# Altium project Analog_Project_Sem_3.PrjPcb
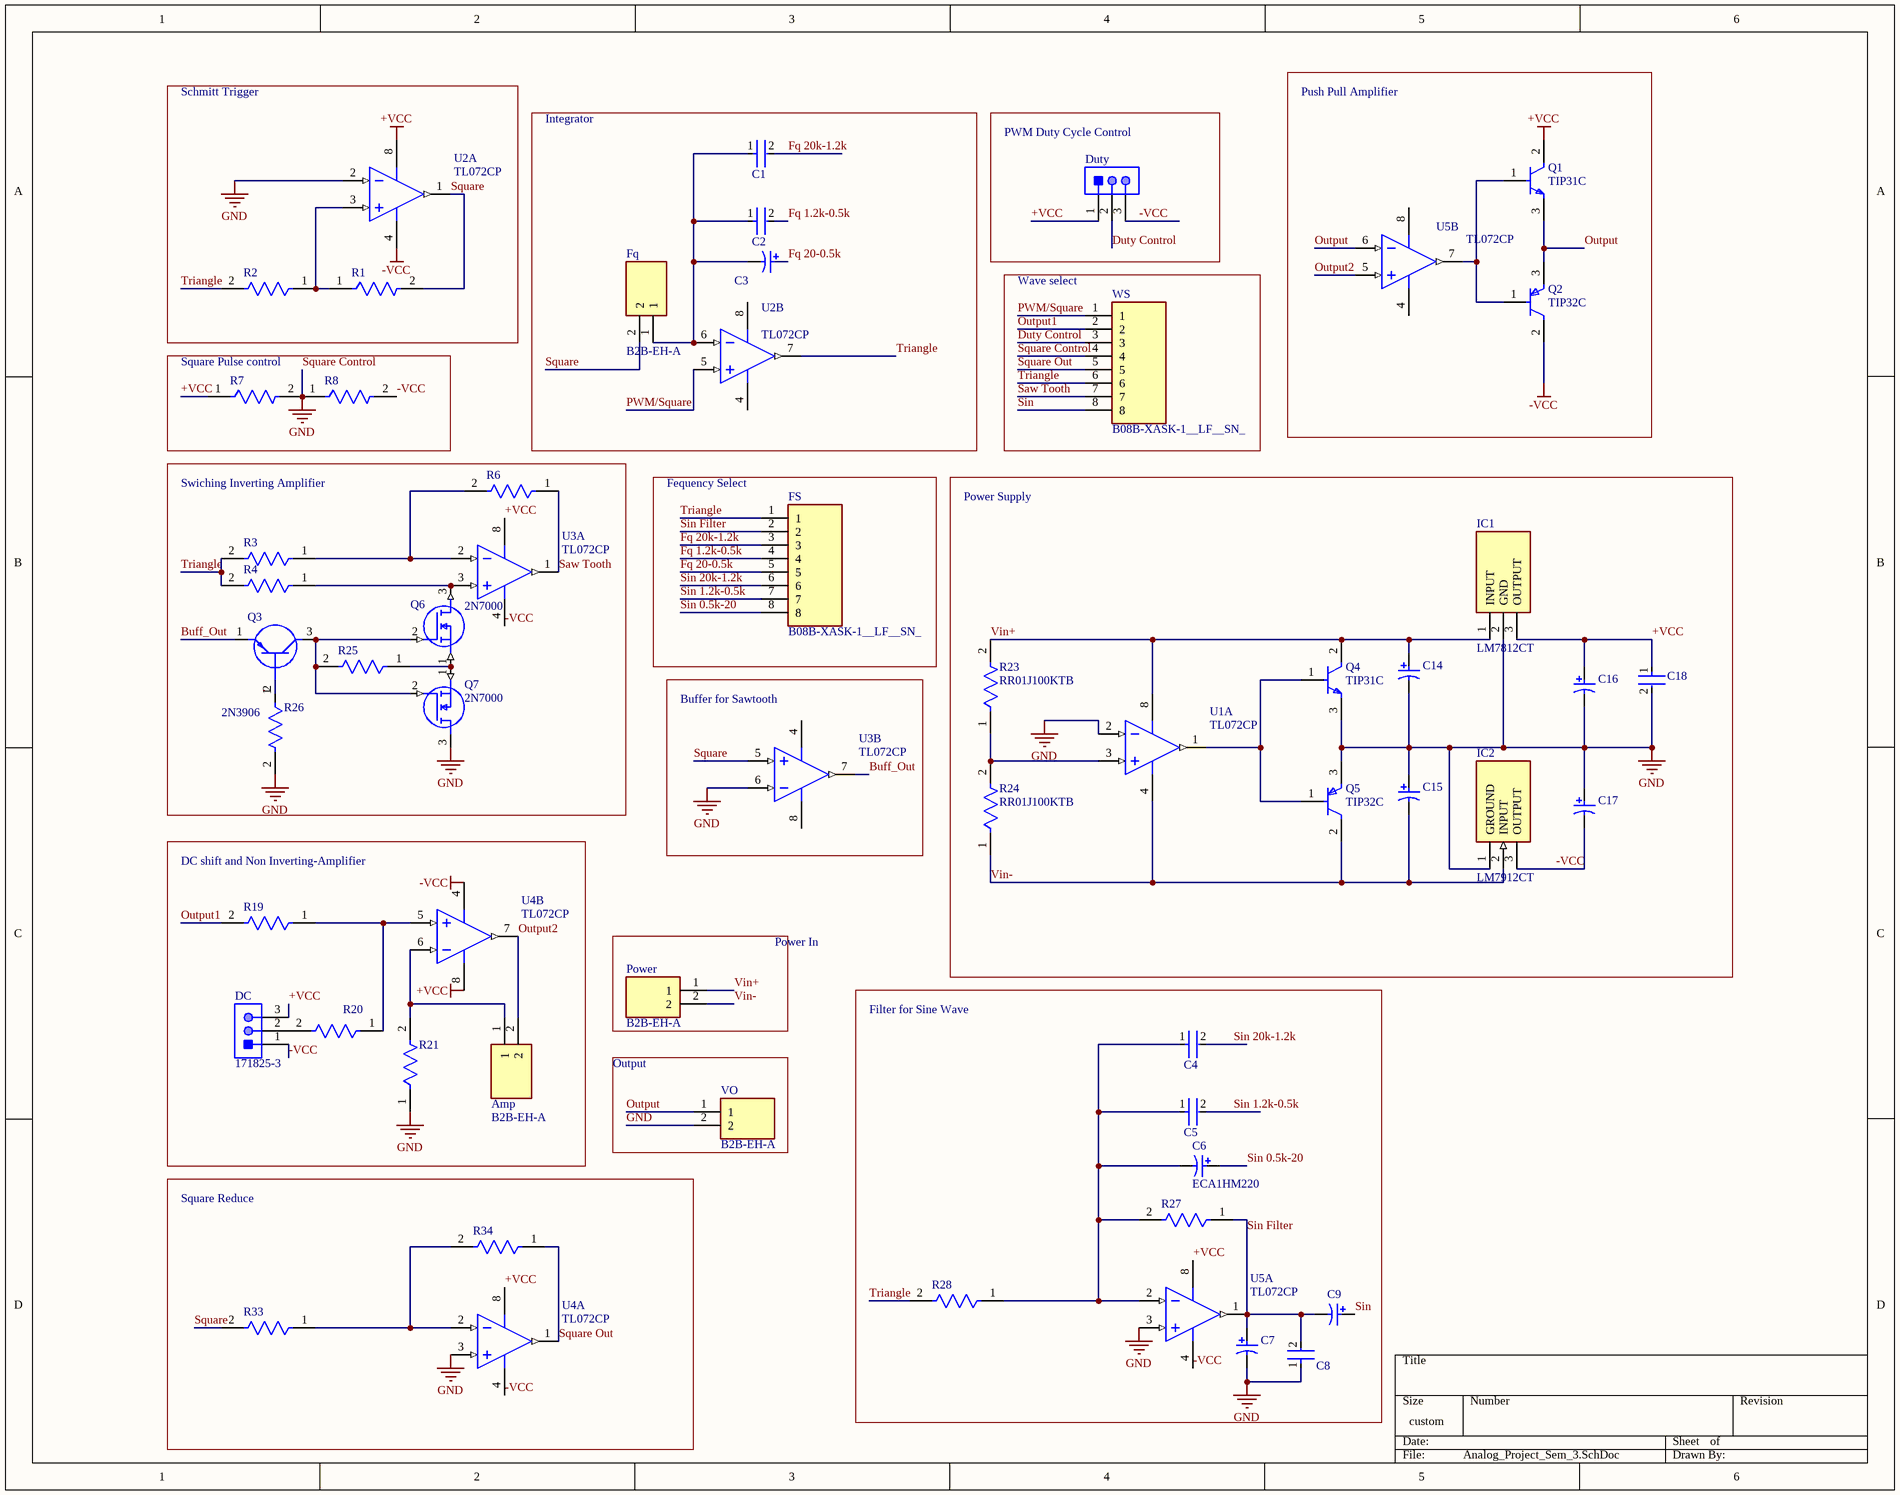
[diagram p0: Analog_Project_Sem_3.SchDoc]
1 sheet, 54 parts. Net scope: global (net labels, ports and power ports of the same name join across sheets).
Board files: PCB1.PcbDoc, Analog_Project_Sem_3.PcbDoc

## Sheet Analog_Project_Sem_3.SchDoc
size 355 x 279 mm; SheetNumber: 1; SheetTotal: 1

### Parts
Amp  B2B-EH-A  [SHDR2W64P0X250_1X2_750X380X600P]
C1  RCER72A104K1A2H03B  [FP-RCE1A2-MFG]  (value not drawn)
C2  RCER72A104K1A2H03B  [FP-RCE1A2-MFG]  (value not drawn)
C3  ECA1HM220  [CAPPR55-200-1100X500X1200]  (value not drawn)
C4  RCER72A104K1A2H03B  [FP-RCE1A2-MFG]  (value not drawn)
C5  RCER72A104K1A2H03B  [FP-RCE1A2-MFG]  (value not drawn)
C6  ECA1HM220  [CAPPR55-200-1100X500X1200]
C7  ECA1HM220  [CAPPR55-200-1100X500X1200]  (value not drawn)
C8  RCER72A104K1A2H03B  [FP-RCE1A2-MFG]  (value not drawn)
C9  ECA1HM220  [CAPPR55-200-1100X500X1200]  (value not drawn)
C14  ECA1HM220  [CAPPR55-200-1100X500X1200]  (value not drawn)
C15  ECA1HM220  [CAPPR55-200-1100X500X1200]  (value not drawn)
C16  ECA1HM220  [CAPPR55-200-1100X500X1200]  (value not drawn)
C17  ECA1HM220  [CAPPR55-200-1100X500X1200]  (value not drawn)
C18  RCER72A104K1A2H03B  [FP-RCE1A2-MFG]  (value not drawn)
DC  171825-3  [TECO-171825-3_V]
Duty  171825-3  [TECO-171825-3_V]  (value not drawn)
Fq  B2B-EH-A  [SHDR2W64P0X250_1X2_750X380X600P]
FS  B08B-XASK-1__LF__SN_  [SHDR8W60P0X250_1X8_2250X640X880P]
IC1  LM7812CT  [TO254P470X1016X2019-3P]
IC2  LM7912CT  [TO254P483X1016X2261-3P]
Power  B2B-EH-A  [SHDR2W64P0X250_1X2_750X380X600P]
Q1  TIP31C  [FP-TO-220-P0A0015988-MFG]
Q2  TIP32C  [FP-TO-220-P0A0015988-MFG]
Q3  2N3906  [2N5457]
Q4  TIP31C  [FP-TO-220-P0A0015988-MFG]
Q5  TIP32C  [FP-TO-220-P0A0015988-MFG]
Q6  2N7000  [TO-92_(TO-226)]
Q7  2N7000  [TO-92_(TO-226)]
R1  (no value)  [FP-MRS1600-MFG]
R2  (no value)  [FP-MRS1600-MFG]
R3  (no value)  [FP-MRS1600-MFG]
R4  (no value)  [FP-MRS1600-MFG]
R6  (no value)  [FP-MRS1600-MFG]
R7  (no value)  [FP-MRS1600-MFG]
R8  (no value)  [FP-MRS1600-MFG]
R19  (no value)  [FP-MRS1600-MFG]
R20  (no value)  [FP-MRS1600-MFG]
R21  (no value)  [FP-MRS1600-MFG]
R23  RR01J100KTB  [FP-RR01-MFG]
R24  RR01J100KTB  [FP-RR01-MFG]
R25  (no value)  [FP-MRS1600-MFG]
R26  (no value)  [FP-MRS1600-MFG]
R27  (no value)  [FP-MRS1600-MFG]
R28  (no value)  [FP-MRS1600-MFG]
R33  (no value)  [FP-MRS1600-MFG]
R34  (no value)  [FP-MRS1600-MFG]
U1  TL072CP  [P0008A]  (part A of 2)
U2  TL072CP  [P0008A]  (parts A,B of 2)
U3  TL072CP  [P0008A]  (parts A,B of 2)
U4  TL072CP  [P0008A]  (parts A,B of 2)
U5  TL072CP  [P0008A]  (parts A,B of 2)
VO  B2B-EH-A  [SHDR2W64P0X250_1X2_750X380X600P]
WS  B08B-XASK-1__LF__SN_  [SHDR8W60P0X250_1X8_2250X640X880P]

### Blocks framed on the sheet
Schmitt Trigger: R1 R2 U2
Integrator: C1-C3 Fq U2
PWM Duty Cycle Control: Duty
Push Pull Amplifier: Q1 Q2 U5
Wave select: WS
Square Pulse control: R7 R8
Swiching Inverting Amplifier: Q3 Q6 Q7 R3 R4 R6 R25 R26 U3
Fequency Select: FS
Power Supply: C14-C18 IC1 IC2 Q4 Q5 R23 R24 U1
Buffer for Sawtooth: U3
DC shift and Non Inverting-Amplifier: Amp DC R19-R21 U4
Power In: Power
Filter for Sine Wave: C4-C9 R27 R28 U5
Output: VO
Square Reduce: R33 R34 U4

### Nets
+VCC: C16.1 C18.1 DC.3 Duty.1 IC1.3(OUTPUT) Q1.2(C) R7.1 U2.8(VCC+) U3.8(VCC+) U4.8(VCC+) U5.8(VCC+)
-VCC: C17.2 DC.1 Duty.3 IC2.3(OUTPUT) Q2.2(C) R8.2 U2.4(VCC-) U3.4(VCC-) U4.4(VCC-) U5.4(VCC-)
GND: C7.2 C8.1 C14.2 C15.1 C16.2 C17.1 C18.2 IC1.2(GND) IC2.1(GROUND) Q4.3(E) Q5.3(E) Q7.3(D) R7.2 R8.1 R21.1 R26.2 U1.2(IN1-) U2.2(IN1-) U3.6(IN2-) U4.3(IN1+) U5.3(IN1+) VO.2 WS.4  [also labelled Square Control]
Buff_Out: Q3.1(E) U3.7(OUT2)
Duty Control: Duty.2 WS.3
Fq 1.2k-0.5k: C2.2 FS.4
Fq 20-0.5k: C3.1 FS.5
Fq 20k-1.2k: C1.2 FS.3
Output: Q1.3(E) Q2.3(E) U5.6(IN2-) VO.1
Output1: R19.2 WS.2
Output2: Amp.2 U4.7(OUT2) U5.5(IN2+)
PWM/Square: U2.5(IN2+) WS.1
Saw Tooth: R6.1 U3.1(OUT1) WS.7
Sin: C9.1 WS.8
Sin 0.5k-20: C6.1 FS.8
Sin 1.2k-0.5k: C5.2 FS.7
Sin 20k-1.2k: C4.2 FS.6
Sin Filter: C7.1 C8.2 C9.2 FS.2 R27.1 U5.1(OUT1)
Square: Fq.2 R1.2 R33.2 U2.1(OUT1) U3.5(IN2+)
Square Out: R34.1 U4.1(OUT1) WS.5
Triangle: FS.1 R2.2 R3.2 R4.2 R28.2 U2.7(OUT2) WS.6
Vin+: C14.1 IC1.1(INPUT) Power.1 Q4.2(C) R23.2 U1.8(VCC+)
Vin-: C15.2 IC2.2(INPUT) Power.2 Q5.2(C) R24.1 U1.4(VCC-)
NetAmp_1: Amp.1 R21.2 U4.6(IN2-)
NetC1_1: C1.1 C2.1 C3.2 Fq.1 U2.6(IN2-)
NetC4_1: C4.1 C5.1 C6.2 R27.2 R28.1 U5.2(IN1-)
NetDC_2: DC.2 R20.2
NetQ1_1: Q1.1(B) Q2.1(B) U5.7(OUT2)
NetQ3_2: Q3.2(B) R26.1
NetQ3_3: Q3.3(C) Q6.2(G) Q7.2(G) R25.2
NetQ4_1: Q4.1(B) Q5.1(B) U1.1(OUT1)
NetQ6_1: Q6.1(S) Q7.1(S) R25.1
NetQ6_3: Q6.3(D) R4.1 U3.3(IN1+)
NetR1_1: R1.1 R2.1 U2.3(IN1+)
NetR3_1: R3.1 R6.2 U3.2(IN1-)
NetR19_1: R19.1 R20.1 U4.5(IN2+)
NetR23_1: R23.1 R24.2 U1.3(IN1+)
NetR33_1: R33.1 R34.2 U4.2(IN1-)

### Library data of the parts
Amp Fq Power VO = B2B-EH-A: Connector; Manufacturer_Name: JST (JAPAN SOLDERLESS TERMINALS); Datasheet Link: http://www.jst-mfg.com/product/pdf/eng/eEH.pdf; Height: 6mm; Manufacturer_Part_Number: B2B-EH-A
C1 C2 C4 C5 C8 C18 = CMP-06035-023167-1: Cap Ceramic 100nF 100V X7R ±10% Radial 2.5mm +125°C Automotive Bulk; Lead Diameter: 0.5mm; Lead/Base Style: Straight; Resistor Type: Ceramic; Ratings: AEC-Q200; Mount: Through Hole; Termination: Radial; Capacitance: 100nF; Voltage Rating (DC): 100V; Max Operating Temperature: 125°C; Min Operating Temperature: -55°C; Case/Package: Radial; Tolerance: 10%; Length: 0.157inch; Voltage Rating: 100V; Width: 0.098inch; Packaging: Bulk; Package Quantity: 500; Lead Free: Lead Free; Height: 3.5mm; Dielectric: X7R; Height - Seated (Max): 0.138inch; Lead Pitch: 0.098inch
C3 C6 C7 C9 C14-C17 = CMP-1665-00036-2: Aluminum Electrolytic Capacitor, 22 uF, +/- 20%, 50 V, -40 to 85 degC, 2-Pin THD, RoHS, Bulk; Manufacturer: Panasonic; Ripple Current: 100mA; Life (Hours): 2000Hour; Voltage: 50V; Dissipation Factor: 0.12%; Leakage Current: 3uA; Lead/Base Style: Straight; Capacitance: 22uF; Lead Diameter: 0.5mm; Max Operating Temperature: 85degC; Height: 11mm; Package Reference: CAPPR55-200-1100X500X1200; Radiation Hardening: No; RoHSCompliant: true; Termination: Radial; Case/Package: Radial; REACH SVHC: NoSVHC; Height - Seated (Max): 0.472inch; Min Operating Temperature: -40degC; Packaging: Bulk; Manufacturer URL: http://www.panasonic.com/; Length: 11mm; Tolerance: 20%; Voltage Rating: 50V; Voltage Rating (DC): 50V; Datasheet URL: https://industrial.panasonic.com/cdbs/www-data/pdf/RDF0000/ABA0000C1218.pdf; Lead Pitch: 2mm; Ripple Current (AC): 100mA; Package Description: 2-Pin Radial Lead, Dia 5 mm, Height 12 mm; Diameter: 5mm; Datasheet Version: Rev. 05, 10/2016; Package Quantity: 200; Mount: ThroughHole
DC Duty = CMP-2000-07494-1: Male Header, Pitch 2.5 mm, 1 x 3 Position, Height 10.4 mm, Tail Length 3.6 mm, / -20 to 95 degC / , RoHS, Bulk; Manufacturer: TE Connectivity; Mating Alignment: Yes(With); Tail Length: 0.142inch; Mating Post Length: 7.5mm; PCB Thickness: 0.063inch; PCB Mount Alignment: No(Without); Voltage Rating: 350V; Max Voltage Rating (AC): 250V; Plating Thickness: 0.8um; PCB Mounting Orientation: Vertical; Number of Positions: 3; PCB Mount Retention: Without; Max Current Rating: 3.5A; Max Voltage Rating (DC): 350.25kV; Pitch: 2.5mm; Approvals: UL; Contact Resistance: 20mOhm; Mount: ThroughHole; Length: 7.5mm; Orientation: Straight; Contact Mating Length: 0.295inch; Contact Material: Brass; Housing Material: Nylon; Package Description: Male Header, Pitch 2.5 mm, 1 x 3 Position, Height 10.4 mm, Tail Length 3.6 mm; Colour: Natural; Backwall/Post Interruptions: No(Without); Min Operating Temperature: -20degC; Mating Retention: Yes(With); Connector Type: Header; Packaging: Bag; RoHSCompliant: True; Package Reference: 171825-3; Contact Shape: Square; Strain Relief: No(Without); Contact Gender: Male; Number of Contacts: 3; Manufacturer URL: http://www.te.com/; Height: 0.409inch; Contact Retention: No(Without); Datasheet Version: Rev. Y3, 12/2016; Panel Mount Retention: No(Without); Datasheet URL: http://www.te.com/commerce/DocumentDelivery/DDEController?Action=showdoc&DocId=Customer+Drawing%7F171825%7FY3%7Fpdf%7FEnglish%7FENG_CD_171825_Y3.pdf%7F171825-3; Termination: Solder; Mounting Technology: ThroughHole; Max Operating Temperature: 95degC; Flammability Rating: UL94V-0; REACH SVHC: NoSVHC; Housing Colour: Natural; Package Quantity: 1000; Number of Rows: 1; Depth: 4.9mm; Contact Plating: Tin
FS WS = B08B-XASK-1__LF__SN_: Connector; Manufacturer_Name: JST (JAPAN SOLDERLESS TERMINALS); Manufacturer_Part_Number: B08B-XASK-1 (LF)(SN); Datasheet Link: http://uk.rs-online.com/web/p/products/1667521; Height: 8.8mm
IC1 = LM7812CT: Integrated Circuit; Manufacturer_Name: onsemi; Datasheet Link: https://datasheet.datasheetarchive.com/originals/distributors/Datasheets_SAMA/704b005d7d2d9ced5864f40b6609c1bc.pdf; Height: 4.7mm; Manufacturer_Part_Number: LM7812CT; Mouser Part Number: 512-LM7812CT; Mouser Price/Stock: https://www.mouser.co.uk/ProductDetail/ON-Semiconductor-Fairchild/LM7812CT?qs=VOMQJJE%252BBNkfAU1Xmn60XA%3D%3D; Arrow Part Number: LM7812CT; Arrow Price/Stock: https://www.arrow.com/en/products/lm7812ct/on-semiconductor
IC2 = LM7912CT: Power Supply; Manufacturer_Name: onsemi; Datasheet Link: https://componentsearchengine.com/Datasheets/2/LM7912CT.pdf; Height: 4.83mm; Manufacturer_Part_Number: LM7912CT; Mouser Part Number: 512-LM7912CT; Mouser Price/Stock: https://www.mouser.com/Search/Refine.aspx?Keyword=512-LM7912CT; Arrow Part Number: LM7912CT; Arrow Price/Stock: https://www.arrow.com/en/products/lm7912ct/on-semiconductor
Q1 Q4 = CMP-12195-000001-1: TRANS NPN 100V 3A TO-220; Manufacturer: STMicroelectronics; Hfe Max: 50; Number Of Npn: 1; Max Junction Temp: +150°C; Standoff Height: 3.5mm; Emitter Base Voltage: 5V; Collector Emitter Saturation Voltage: 1.2V; Power Dissipation: 2W; Hfe Testvce: 4V; Hfe Min: 10; Device Class L2: Transistors; ComponentLink2URL: https://www.st.com/resource/en/datasheet/tip31c.pdf; Device Class L1: Discrete Semiconductors; Digikey Description: TRANS NPN 100V 3A TO-220; Max Collector Current: 3A; RoHS: TRUE; Height: 19.68mm; Mouser Description: Bipolar Transistors - BJT NPN Gen Pur Power; Number Of Elements: 1; Package: TO-220-P0A0015988; Temperature: to +150°C; Octopart: https://octopart.com/tip31c-stmicroelectronics-15555; Manufacturer Part Number: TIP31C; Category: Trans; Hfe Testic: 3A; Lead Free: Yes; Collector Base Voltage: 100V; Device Class L3: BJTs; Collector Emitter Voltage: 100V; Automotive: No; ComponentLink2Description: Datasheet; Temperature Range High: +150°C
Q2 Q5 = CMP-12195-000005-1: TRANS PNP 100V 3A TO-220; Manufacturer: STMicroelectronics; Standoff Height: 3.5mm; Number Of Pnp: 1; Max Collector Current: -3A; Emitter Base Voltage: -5V; Collector Emitter Voltage: -100V; Hfe Testvce: -4V; Hfe Max: 50; Collector Emitter Saturation Voltage: -1.2V; Power Dissipation: 2W; Max Junction Temp: +150°C; Hfe Min: 10; Device Class L3: BJTs; Mouser Description: Original ST Microelectronics Transistor, 100V, 3A, .22 Ohm, TO-220 Package; ComponentLink2Description: Datasheet; Device Class L1: Discrete Semiconductors; Automotive: No; Number Of Elements: 1; Category: Trans; Collector Base Voltage: -100V; Package: TO-220-P0A0015988; Height: 19.68mm; Lead Free: Yes; ComponentLink2URL: https://www.st.com/resource/en/datasheet/tip32c.pdf; Hfe Testic: -3A; RoHS: TRUE; Temperature Range High: +150°C; Temperature: to +150°C; Device Class L2: Transistors; Digikey Description: TRANS PNP 100V 3A TO-220; Octopart: https://octopart.com/tip32c-stmicroelectronics-353617; Manufacturer Part Number: TIP32C
Q3 = 2N3906: Transistor BJT PNP; Manufacturer_Name: Central Semiconductor; Datasheet Link: http://www.mouser.com/datasheet/2/68/2n3905-29545.pdf; Height: 5.33mm; Manufacturer_Part_Number: 2N3906; Mouser Part Number: 610-2N3906; Mouser Price/Stock: https://www.mouser.com/Search/Refine.aspx?Keyword=610-2N3906
Q6 Q7 = 2N7000: MOSFET (N-Channel); Manufacturer_Name: onsemi; Datasheet Link: http://www.onsemi.com/pub/Collateral/NDS7002A-D.PDF; Height: 5.33mm; Manufacturer_Part_Number: 2N7000; Mouser Part Number: 512-2N7000; Mouser Price/Stock: https://www.mouser.co.uk/ProductDetail/onsemi-Fairchild/2N7000?qs=FOlmdCx%252BAA2o%2FKZOTk%2F3hg%3D%3D; Arrow Part Number: 2N7000; Arrow Price/Stock: https://www.arrow.com/en/products/2n7000/on-semiconductor?region=europe
R1-R4 R6-R8 R19-R21 R25-R28 R33 R34 = CMP-02408-000019-1: RES 20K OHM 0.4W 1% AXIAL; Max Power Dissipation: 400mW; Temperature Coefficient: 50ppm/°C; Resistance: 20kR; Technology: THIN FILM; Max Operating Temperature: 155°C; Number of Terminations: 2; RoHS Compliant: Yes; Packaging: Tape and Reel; Radiation Hardening: No; Contact Plating: Tin; Military Standard: Not; Construction: Cylindrical; Diameter: 1.6mm; Tolerance: 1%; Mount: Through Hole; Power Rating: 400mW; Case/Package: Conformal; Termination: Axial; Length: 3.6mm; Min Operating Temperature: -55°C; Resistor Type: Metal Film; Series: MRS16
R23 R24 = CMP-03212-000008-1: RES 100K OHM 5% 1W AXIAL; Number of Resistors: 1; Temperature Coefficient: 300ppm/°C; Voltage Rating: 350V; Resistance: 100kR; Package Quantity: 5000; Power Rating: 1W; Packaging: Ammo Pack; Min Operating Temperature: -55°C; Number of Terminations: 2; Resistor Type: Power resistor; Length: 6.8mm; ELV: Compliant; Mount: Axial; RoHS Compliant: Yes; Case/Package: Metal; Diameter: 2.6mm; Termination: Axial; Series: RR; Max Operating Temperature: 155°C; Tolerance: 5%
U1-U5 = CMP-0017-00950-2: Dual Low-Noise JFET-Input General-Purpose Operational Amplifier, 7 to 36 V, 0 to 70 degC, 8-pin DIP (P8), Pb-Free (RoHS); Manufacturer: Texas Instruments; Sub Family: General Purpose Amplifier, High Supply Voltage Amplifier (>=30V); Total Supply Voltage(Max)(+5V is 5, +/-5V is 10): 36; Slew Rate(Typ)(V/us): 13; Vn at 1kHz(Typ)(nV/rtHz): 18; GBW(Typ)(MHz): 3; CMRR(Min)(dB): 70; Total Supply Voltage(Min)(+5V is 5, +/-5V is 10): 7; Vio (25C)(Max)(mV): 10; Rating: Catalog; IIB(Max)(pA): 200; Iq per channel(Max)(mA): 2.5; Number of Channels: 2; Mounting Technology: Through Hole; ComponentLink3Description: Package Specification; PartNumber: TL072CP; PackageVersion: 4040082/E, 04/2010; Eco-Plan: Pb-Free (RoHS); DatasheetVersion: SLOS080J; Offset Drift(Typ)(uV/C): 18; ComponentLink3URL: http://www.ti.com/litv/pdf/mpdi001b; PackageDescription: 8-Pin Plastic In-Line, Body 9.59 x 6.35 mm, Pitch 2.54 mm; Code_JEDEC: MS-001; ComponentLink2URL: http://www.ti.com/lit/ds/symlink/tl072.pdf; ComponentLink1Description: Manufacturer URL; ComponentLink2Description: Datasheet; ComponentLink1URL: http://www.ti.com/; PackageReference: P0008A